# Altium project TMS320F28335GF.PrjPcb
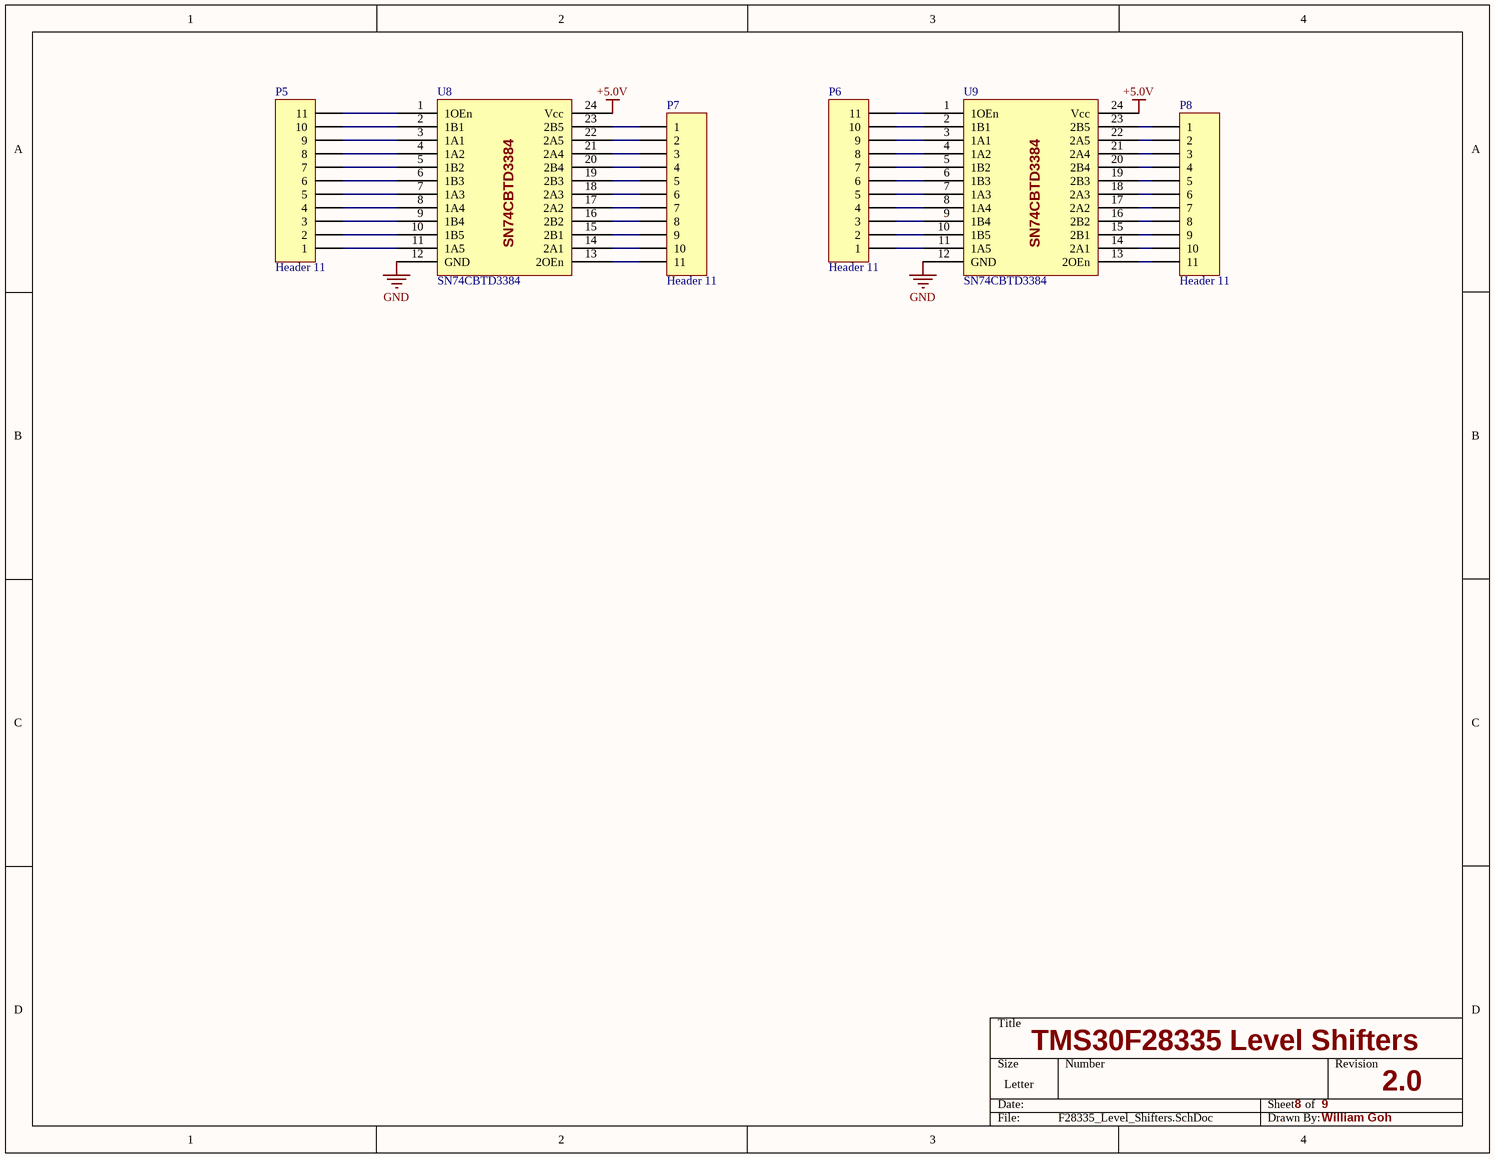
[diagram p0: F28335_Level_Shifters.SchDoc]
5 sheets, 45 parts. Net scope: global (net labels, ports and power ports of the same name join across sheets).
Board file: TMS320F28335GF.PcbDoc
Sheets:
  F28335_Level_Shifters.SchDoc
  Main.SchDoc
    Altera CPLD = F28335_CPLD.SchDoc
    XDS-100 Programmer = XDS_100_USB_Programmer.SchDoc
  TMS320F28335GF.SchDoc

## Sheet F28335_Level_Shifters.SchDoc
size Letter; DocumentNumber: 8; SheetNumber: 8; SheetTotal: 9

### Parts
P5  Header 11  [HDR1X11]
P6  Header 11  [HDR1X11]
P7  Header 11  [HDR1X11]
P8  Header 11  [HDR1X11]
U8  SN74CBTD3384  [DW-24]
U9  SN74CBTD3384  [DW-24]

### Nets
+5.0V: U8.24(Vcc) U9.24(Vcc)
GND: U8.12(GND) U9.12(GND)
NetP5_1: P5.1 U8.11(1A5)
NetP5_2: P5.2 U8.10(1B5)
NetP5_3: P5.3 U8.9(1B4)
NetP5_4: P5.4 U8.8(1A4)
NetP5_5: P5.5 U8.7(1A3)
NetP5_6: P5.6 U8.6(1B3)
NetP5_7: P5.7 U8.5(1B2)
NetP5_8: P5.8 U8.4(1A2)
NetP5_9: P5.9 U8.3(1A1)
NetP5_10: P5.10 U8.2(1B1)
NetP5_11: P5.11 U8.1(1OEn)
NetP6_1: P6.1 U9.11(1A5)
NetP6_2: P6.2 U9.10(1B5)
NetP6_3: P6.3 U9.9(1B4)
NetP6_4: P6.4 U9.8(1A4)
NetP6_5: P6.5 U9.7(1A3)
NetP6_6: P6.6 U9.6(1B3)
NetP6_7: P6.7 U9.5(1B2)
NetP6_8: P6.8 U9.4(1A2)
NetP6_9: P6.9 U9.3(1A1)
NetP6_10: P6.10 U9.2(1B1)
NetP6_11: P6.11 U9.1(1OEn)
NetP7_1: P7.1 U8.23(2B5)
NetP7_2: P7.2 U8.22(2A5)
NetP7_3: P7.3 U8.21(2A4)
NetP7_4: P7.4 U8.20(2B4)
NetP7_5: P7.5 U8.19(2B3)
NetP7_6: P7.6 U8.18(2A3)
NetP7_7: P7.7 U8.17(2A2)
NetP7_8: P7.8 U8.16(2B2)
NetP7_9: P7.9 U8.15(2B1)
NetP7_10: P7.10 U8.14(2A1)
NetP7_11: P7.11 U8.13(2OEn)
NetP8_1: P8.1 U9.23(2B5)
NetP8_2: P8.2 U9.22(2A5)
NetP8_3: P8.3 U9.21(2A4)
NetP8_4: P8.4 U9.20(2B4)
NetP8_5: P8.5 U9.19(2B3)
NetP8_6: P8.6 U9.18(2A3)
NetP8_7: P8.7 U9.17(2A2)
NetP8_8: P8.8 U9.16(2B2)
NetP8_9: P8.9 U9.15(2B1)
NetP8_10: P8.10 U9.14(2A1)
NetP8_11: P8.11 U9.13(2OEn)

### Notes on the sheet
- TMS30F28335 Level Shifters
- 2.0
- William Goh

### Library data of the parts
P5-P8 = Header 11: Header, 11-Pin; LatestRevisionDate: 17-Jul-2002; LatestRevisionNote: Re-released for DXP Platform.; Publisher: Altium Limited
U8 U9 = SN74CBTD3384: 10-Bit FET Bus Switches With Level Shifting; Digikey #: 296-6482-1-ND

## Sheet Main.SchDoc
size Letter; DocumentNumber: 1; SheetNumber: 1; SheetTotal: 9
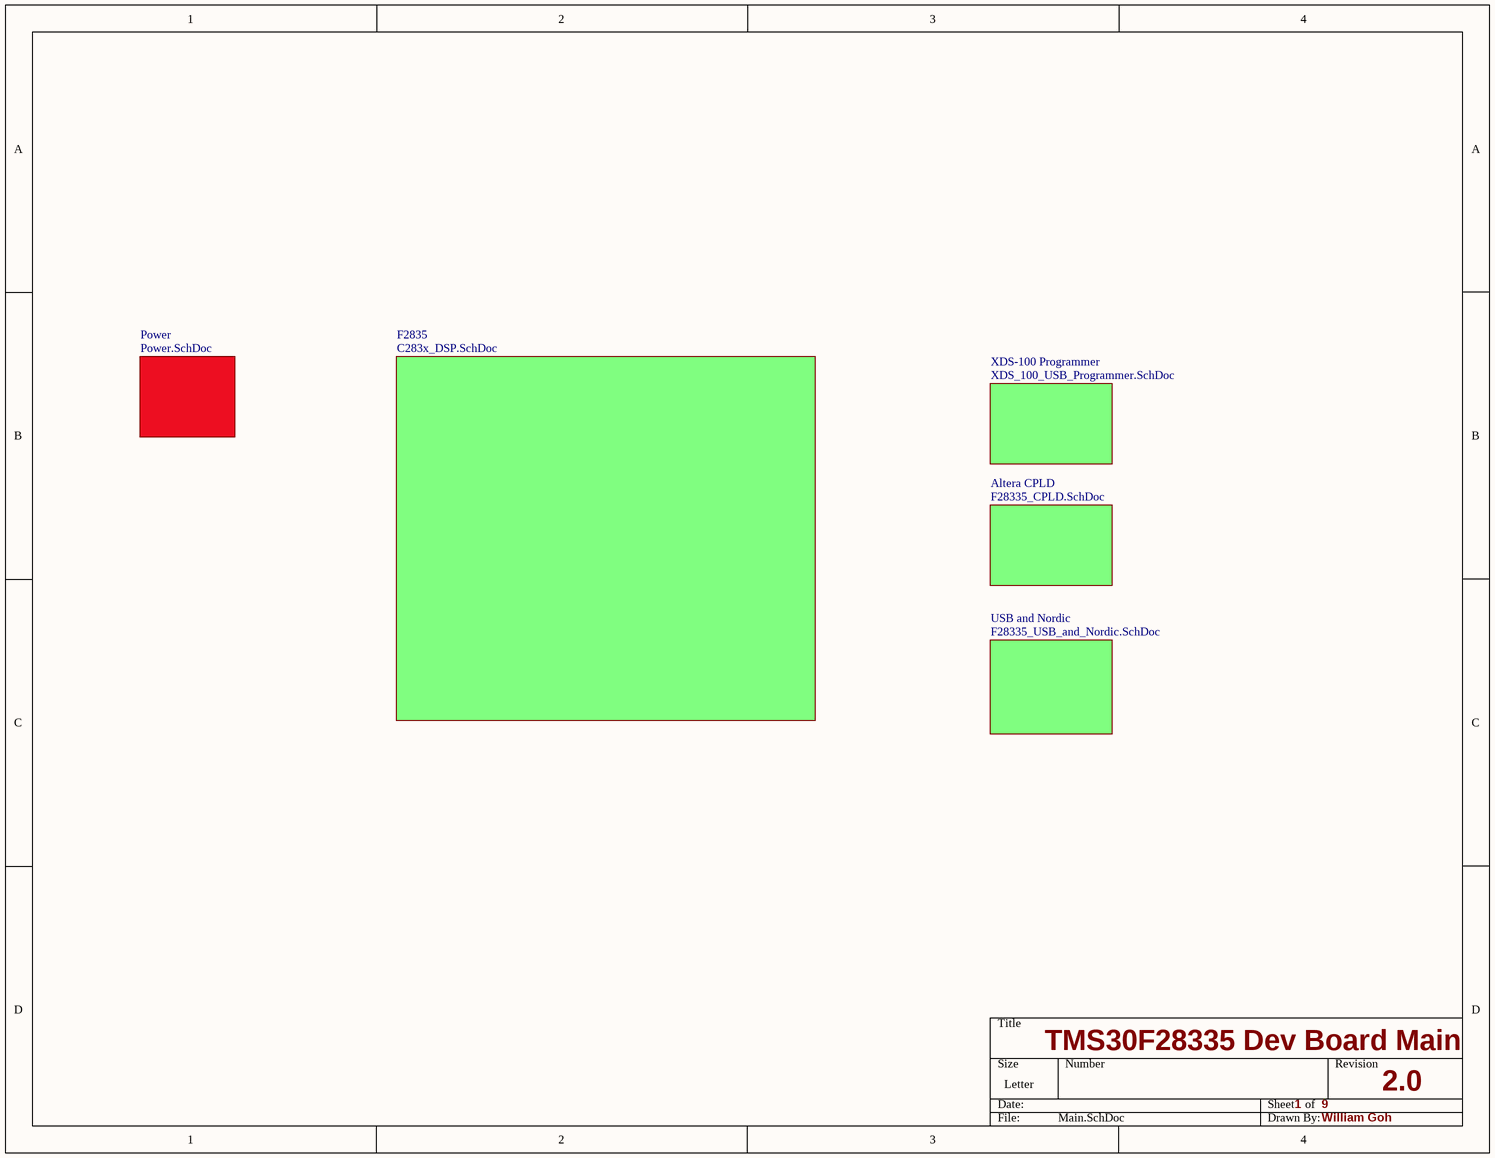
[diagram p1: Main.SchDoc]

### Sub-sheets
Altera CPLD = F28335_CPLD.SchDoc: no entries
F2835 = C283x_DSP.SchDoc (file not in this document): no entries
Power = Power.SchDoc (file not in this document): no entries
USB and Nordic = F28335_USB_and_Nordic.SchDoc (file not in this document): no entries
XDS-100 Programmer = XDS_100_USB_Programmer.SchDoc: no entries

### Notes on the sheet
- TMS30F28335 Dev Board Main
- 2.0
- William Goh

## Sheet F28335_CPLD.SchDoc
size Letter; DocumentNumber: 4; SheetNumber: 4; SheetTotal: 9
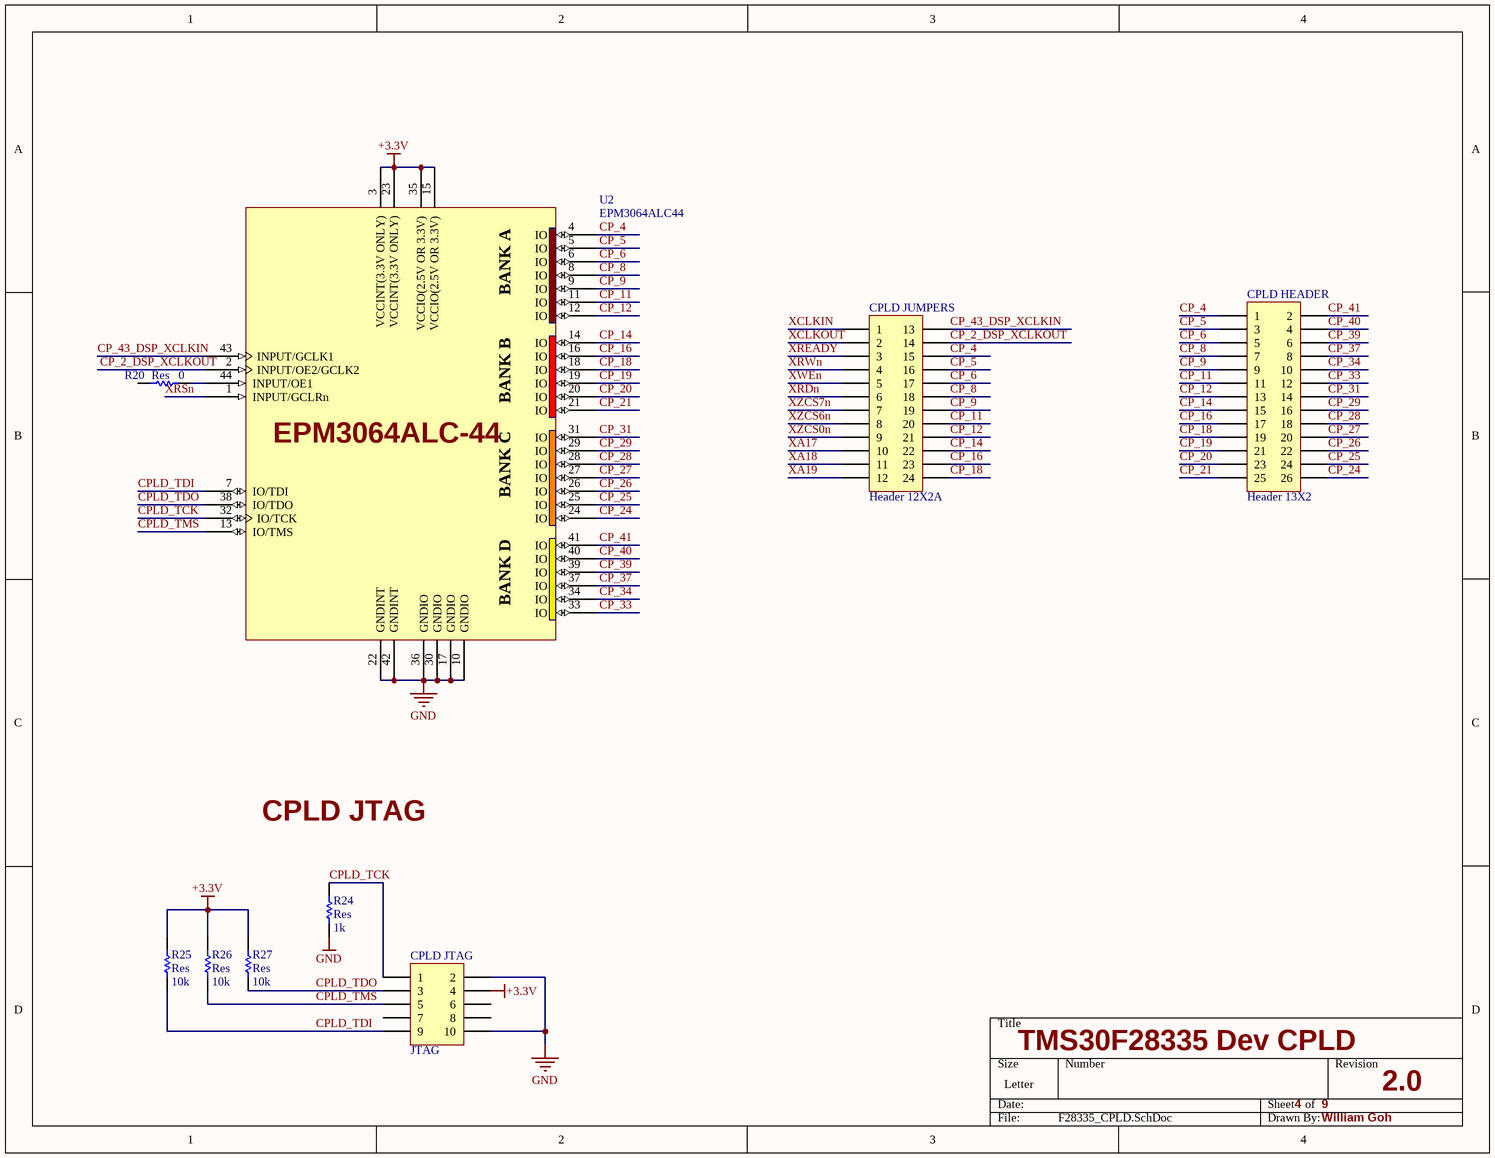
[diagram p2: F28335_CPLD.SchDoc]

### Parts
CPLD_HEADER  Header 13X2  [HDR2X13]
CPLD_JTAG  JTAG  [HDR2X5]
CPLD_JUMPERS  Header 12X2A  [HDR2X12_CEN]
R20  Res  value 0  [0805]
R24  Res  value 1k  [0805]
R25  Res  value 10k  [0805]
R26  Res  value 10k  [0805]
R27  Res  value 10k  [0805]
U2  EPM3064ALC44  [PLCC_44]

### Nets
+3.3V: CPLD_JTAG.4 R25.2 R26.2 R27.2 U2.3(VCCINT(3.3V_ONLY)) U2.15(VCCIO(2.5V_OR_3.3V)) U2.23(VCCINT(3.3V_ONLY)) U2.35(VCCIO(2.5V_OR_3.3V))
GND: CPLD_JTAG.2 CPLD_JTAG.10 R24.1 U2.10(GNDIO) U2.17(GNDIO) U2.22(GNDINT) U2.30(GNDIO) U2.36(GNDIO) U2.42(GNDINT)
CP_2_DSP_XCLKOUT: CPLD_JUMPERS.14 U2.2(INPUT/OE2/GCLK2)
CP_4: CPLD_HEADER.1 CPLD_JUMPERS.15 U2.4(IO)
CP_5: CPLD_HEADER.3 CPLD_JUMPERS.16 U2.5(IO)
CP_6: CPLD_HEADER.5 CPLD_JUMPERS.17 U2.6(IO)
CP_8: CPLD_HEADER.7 CPLD_JUMPERS.18 U2.8(IO)
CP_9: CPLD_HEADER.9 CPLD_JUMPERS.19 U2.9(IO)
CP_11: CPLD_HEADER.11 CPLD_JUMPERS.20 U2.11(IO)
CP_12: CPLD_HEADER.13 CPLD_JUMPERS.21 U2.12(IO)
CP_14: CPLD_HEADER.15 CPLD_JUMPERS.22 U2.14(IO)
CP_16: CPLD_HEADER.17 CPLD_JUMPERS.23 U2.16(IO)
CP_18: CPLD_HEADER.19 CPLD_JUMPERS.24 U2.18(IO)
CP_19: CPLD_HEADER.21 U2.19(IO)
CP_20: CPLD_HEADER.23 U2.20(IO)
CP_21: CPLD_HEADER.25 U2.21(IO)
CP_24: CPLD_HEADER.26 U2.24(IO)
CP_25: CPLD_HEADER.24 U2.25(IO)
CP_26: CPLD_HEADER.22 U2.26(IO)
CP_27: CPLD_HEADER.20 U2.27(IO)
CP_28: CPLD_HEADER.18 U2.28(IO)
CP_29: CPLD_HEADER.16 U2.29(IO)
CP_31: CPLD_HEADER.14 U2.31(IO)
CP_33: CPLD_HEADER.12 U2.33(IO)
CP_34: CPLD_HEADER.10 U2.34(IO)
CP_37: CPLD_HEADER.8 U2.37(IO)
CP_39: CPLD_HEADER.6 U2.39(IO)
CP_40: CPLD_HEADER.4 U2.40(IO)
CP_41: CPLD_HEADER.2 U2.41(IO)
CP_43_DSP_XCLKIN: CPLD_JUMPERS.13 U2.43(INPUT/GCLK1)
CPLD_TCK: CPLD_JTAG.1 R24.2 U2.32(IO/TCK)
CPLD_TDI: CPLD_JTAG.9 R25.1 U2.7(IO/TDI)
CPLD_TDO: CPLD_JTAG.3 R27.1 U2.38(IO/TDO)
CPLD_TMS: CPLD_JTAG.5 R26.1 U2.13(IO/TMS)
XA17: CPLD_JUMPERS.10
XA18: CPLD_JUMPERS.11
XA19: CPLD_JUMPERS.12
XCLKIN: CPLD_JUMPERS.1
XCLKOUT: CPLD_JUMPERS.2
XRDn: CPLD_JUMPERS.6
XREADY: CPLD_JUMPERS.3
XRSn: U2.1(INPUT/GCLRn)
XRWn: CPLD_JUMPERS.4
XWEn: CPLD_JUMPERS.5
XZCS0n: CPLD_JUMPERS.9
XZCS6n: CPLD_JUMPERS.8
XZCS7n: CPLD_JUMPERS.7
NetR20_2: R20.2 U2.44(INPUT/OE1)

Not connected (* = marked no-connect by the designer): CPLD_JTAG 6 7 8; R20 1

### Notes on the sheet
- CPLD JTAG
- TMS30F28335 Dev CPLD
- 2.0
- William Goh
- (in symbol EPM3064ALC44) BANK A; BANK B; EPM3064ALC-44; BANK C; BANK D

### Library data of the parts
CPLD_HEADER = Header 13X2: Header, 13-Pin, Dual row; LatestRevisionDate: 17-Jul-2002; LatestRevisionNote: Re-released for DXP Platform.; Publisher: Altium Limited
CPLD_JTAG = Header 5X2: Header, 5-Pin, Dual row; Revision: 17-Jul-2002: Re-released for DXP Platform.; Publisher: Altium Limited
CPLD_JUMPERS = Header 12X2A: Header, 12-Pin, Dual row; LatestRevisionDate: 17-Jul-2002; LatestRevisionNote: Re-released for DXP Platform.; Publisher: Altium Limited
R20 R24-R27 = Res Semi: Semiconductor Resistor; Published: 8-Jun-2000; LatestRevisionDate: 17-Jul-2002; LatestRevisionNote: Re-released for DXP Platform.; PackageReference: AXIAL-0.5; Publisher: Altium Limited
U2 = EPM3064ALC44: Altera MAX3000A PLCC

## Sheet XDS_100_USB_Programmer.SchDoc
size Letter; DocumentNumber: 5; SheetNumber: 5; SheetTotal: 9
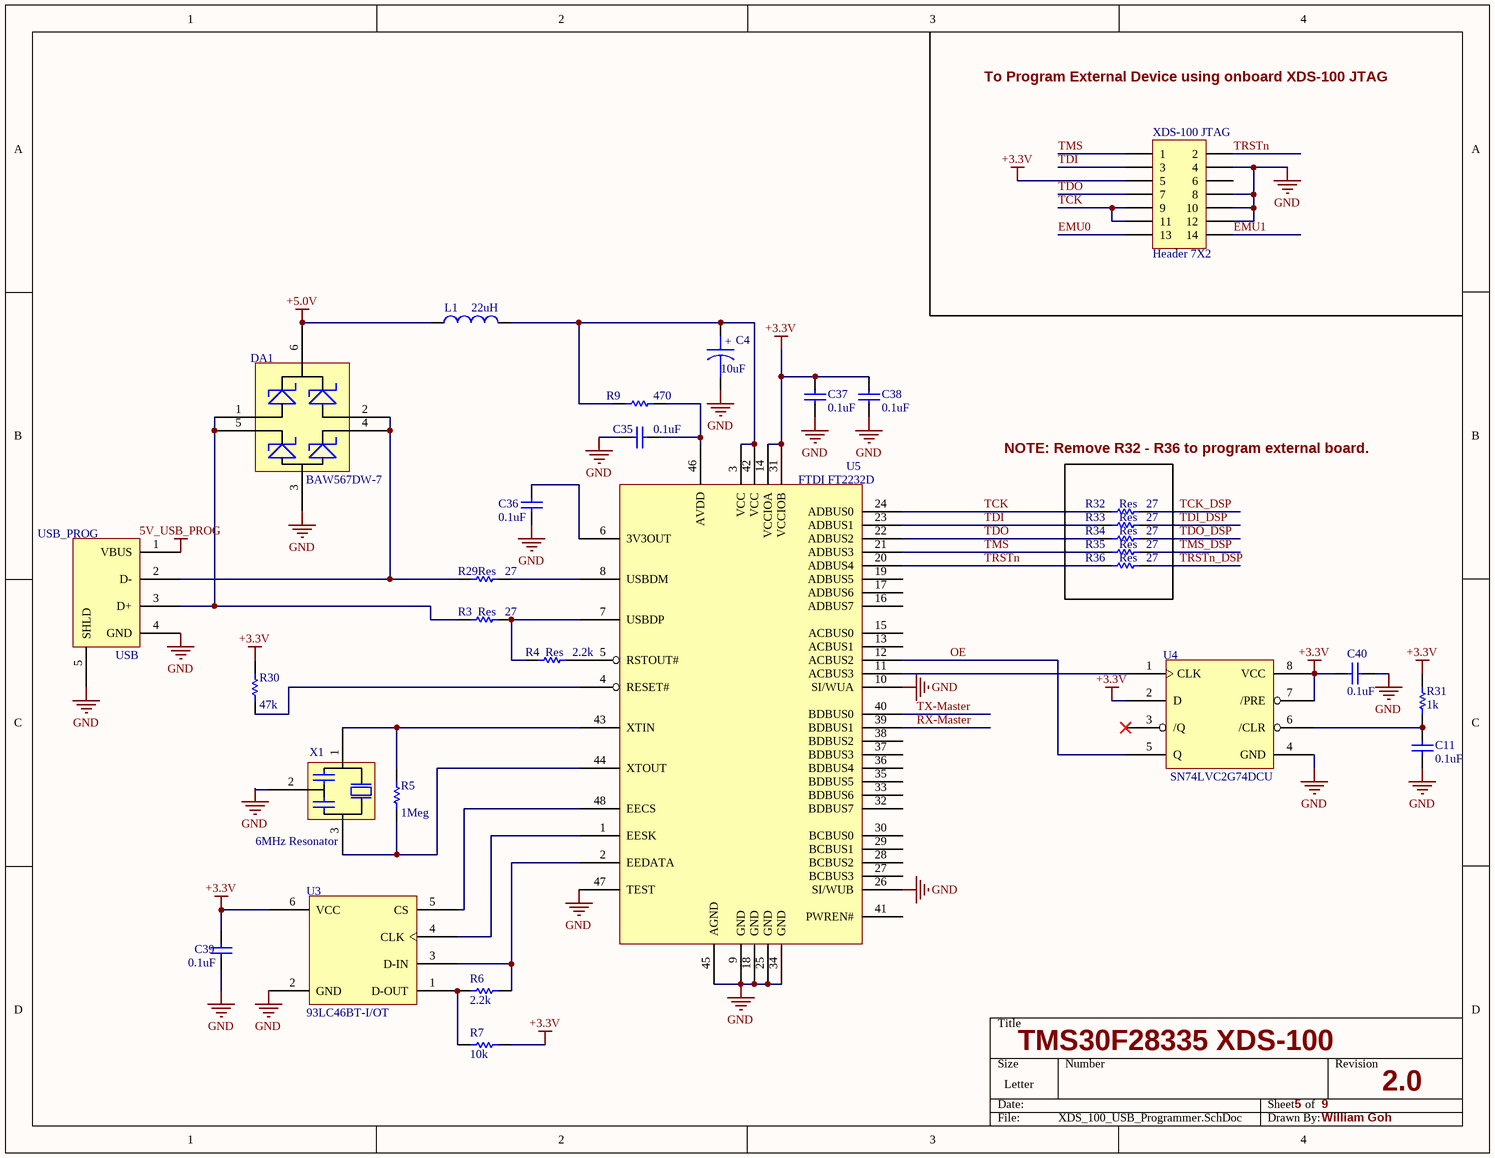
[diagram p3: XDS_100_USB_Programmer.SchDoc]

### Parts
C4  value 10uF  [3528]  (hidden comment: Pol Cap)
C11  value 0.1uF  [0805]  (hidden comment: Cap Semi)
C35  value 0.1uF  [0805]  (hidden comment: Cap Semi)
C36  value 0.1uF  [0805]  (hidden comment: Cap Semi)
C37  value 0.1uF  [0805]  (hidden comment: Cap Semi)
C38  value 0.1uF  [0805]  (hidden comment: Cap Semi)
C39  value 0.1uF  [0805]  (hidden comment: Cap Semi)
C40  value 0.1uF  [0805]  (hidden comment: Cap Semi)
DA1  BAW567DW-7  [BAW567DW]
L1  value 22uH  [0805]  (hidden comment: Inductor)
R3  Res  value 27  [0805]
R4  Res  value 2.2k  [0805]
R5  value 1Meg  [0805]  (hidden comment: Res)
R6  value 2.2k  [0805]  (hidden comment: Res)
R7  value 10k  [0805]  (hidden comment: Res)
R9  value 470  [0805]  (hidden comment: Res)
R29  Res  value 27  [0805]
R30  value 47k  [0805]  (hidden comment: Res)
R31  value 1k  [0805]  (hidden comment: Res)
R32  Res  value 27  [0805]
R33  Res  value 27  [0805]
R34  Res  value 27  [0805]
R35  Res  value 27  [0805]
R36  Res  value 27  [0805]
U3  93LC46BT-I/OT  [93LC46BT-I/OT]
U4  SN74LVC2G74DCU  [DCU8]
U5  FTDI FT2232D  [FTDI FT2232D]
USB_PROG  USB  [USB_TypeB_RightAngle]
X1  6MHz Resonator  [6.00Mhz Resonator]
XDS-100_JTAG  Header 7X2  [HDR2X7]

### Nets
5V_USB_PROG: USB_PROG.1(VBUS)
+3.3V: C37.2 C38.1 C39.2 C40.2 R7.1 R30.2 R31.2 U3.6(VCC) U4.2(D) U4.7(/PRE) U4.8(VCC) U5.14(VCCIOA) U5.31(VCCIOB) XDS-100_JTAG.5
+5.0V: DA1.6 L1.1
GND: C4.2 C11.2 C35.2 C36.1 C37.1 C38.2 C39.1 C40.1 DA1.3 U3.2(GND) U4.4(GND) U5.9(GND) U5.10(SI/WUA) U5.18(GND) U5.25(GND) U5.26(SI/WUB) U5.34(GND) U5.45(AGND) U5.47(TEST) USB_PROG.4(GND) USB_PROG.5(SHLD) X1.2(GND) XDS-100_JTAG.4 XDS-100_JTAG.8 XDS-100_JTAG.10 XDS-100_JTAG.12
EMU0: XDS-100_JTAG.13
EMU1: XDS-100_JTAG.14
OE: U4.5(Q) U5.12(ACBUS2)
RX-Master: U5.39(BDBUS1)
TCK: R32.1 U5.24(ADBUS0) XDS-100_JTAG.9 XDS-100_JTAG.11
TCK_DSP: R32.2
TDI: R33.1 U5.23(ADBUS1) XDS-100_JTAG.3
TDI_DSP: R33.2
TDO: R34.1 U5.22(ADBUS2) XDS-100_JTAG.7
TDO_DSP: R34.2
TMS: R35.1 U5.21(ADBUS3) XDS-100_JTAG.1
TMS_DSP: R35.2
TRSTn: R36.1 U5.20(ADBUS4) XDS-100_JTAG.2
TRSTn_DSP: R36.2
TX-Master: U5.40(BDBUS0)
NetC4_1: C4.1 L1.2 R9.2 U5.3(VCC) U5.42(VCC)
NetC11_1: C11.1 R31.1 U4.6(/CLR)
NetC35_1: C35.1 R9.1 U5.46(AVDD)
NetC36_2: C36.2 U5.6(3V3OUT)
NetDA1_1: DA1.1 DA1.5 R3.1 USB_PROG.3(D+)
NetDA1_2: DA1.2 DA1.4 R29.1 USB_PROG.2(D-)
NetR3_2: R3.2 R4.1 U5.7(USBDP)
NetR4_2: R4.2 U5.5(RSTOUT#)
NetR5_1: R5.1 U5.44(XTOUT) X1.3
NetR5_2: R5.2 U5.43(XTIN) X1.1
NetR6_1: R6.1 U3.3(D-IN) U5.2(EEDATA)
NetR6_2: R6.2 R7.2 U3.1(D-OUT)
NetR29_2: R29.2 U5.8(USBDM)
NetR30_1: R30.1 U5.4(RESET#)
NetU3_4: U3.4(CLK) U5.1(EESK)
NetU3_5: U3.5(CS) U5.48(EECS)
NetU4_1: U4.1(CLK) U5.11(ACBUS3)

Not connected (* = marked no-connect by the designer): U4 3(/Q)*; U5 13(ACBUS1) 15(ACBUS0) 16(ADBUS7) 17(ADBUS6) 19(ADBUS5) 27(BCBUS3) 28(BCBUS2) 29(BCBUS1) 30(BCBUS0) 32(BDBUS7) 33(BDBUS6) 35(BDBUS5) 36(BDBUS4) 37(BDBUS3) 38(BDBUS2) 41(PWREN#); XDS-100_JTAG 6

### Notes on the sheet
- To Program External Device using onboard XDS-100 JTAG
- NOTE: Remove R32 - R36 to program external board.
- TMS30F28335 XDS-100
- 2.0
- William Goh
- (in symbol CAPACITOR POL) +

### Library data of the parts
C4 = CAPACITOR POL: Capacitor Tantalum; Digikey #: 495-2203-1-ND
C11 C35-C40 = Cap Semi: Capacitor (Semiconductor SIM Model); Published: 8-Jun-2000; LatestRevisionDate: 17-Jul-2002; LatestRevisionNote: Re-released for DXP Platform.; PackageReference: C1206; Publisher: Altium Limited
DA1 = BAW567DW-7: QUAD SURFACE MOUNT SWITCHING DIODE ARRAY; Digikey #: BAW567DWDICT-ND
L1 = Inductor: Code_IEC: 1005; Published: 8-Jun-2000; LatestRevisionDate: 17-Jul-2002; LatestRevisionNote: Re-released for DXP Platform.; PackageReference: 0402-A; Publisher: Altium Limited; Code_JEITA: 0402; Digikey #: 490-4030-1-ND
R3-R7 R9 R29-R36 = Res Semi: Semiconductor Resistor; Published: 8-Jun-2000; LatestRevisionDate: 17-Jul-2002; LatestRevisionNote: Re-released for DXP Platform.; PackageReference: AXIAL-0.5; Publisher: Altium Limited
U3 = 93LC46BT-I/OT: 1K Microwire Compatible Serial EEPROM; Digikey #: 93LC46BT-I/OTCT-ND
U4 = LVC2G74: Single Positive-Edge-Triggered D-Type Flip-Flop with Clear and Preset; Digikey #: 296-12755-1-ND
X1 = Resonator Ceramic: Ceramic Resonator; Digikey #: 490-1218-1-ND
XDS-100_JTAG = Header 7X2: Header, 7-Pin, Dual row; LatestRevisionDate: 17-Jul-2002; LatestRevisionNote: Re-released for DXP Platform.; Publisher: Altium Limited; Digikey #: HRP14H-ND
U5 = FTDI FT2232D: Digikey #: 768-1010-1-ND
USB_PROG = USB: Digikey #: 151-1121-ND

## Sheet TMS320F28335GF.SchDoc
size A

## Nets that join several sheets
+3.3V: F28335_CPLD (8 pins), XDS_100_USB_Programmer (14 pins)
+5.0V: F28335_Level_Shifters (U8.24 U9.24), XDS_100_USB_Programmer (DA1.6 L1.1)
GND: F28335_Level_Shifters (U8.12 U9.12), F28335_CPLD (9 pins), XDS_100_USB_Programmer (26 pins)